# EAGLE schematic EGR226 Project (EAGLE 8.2.2)
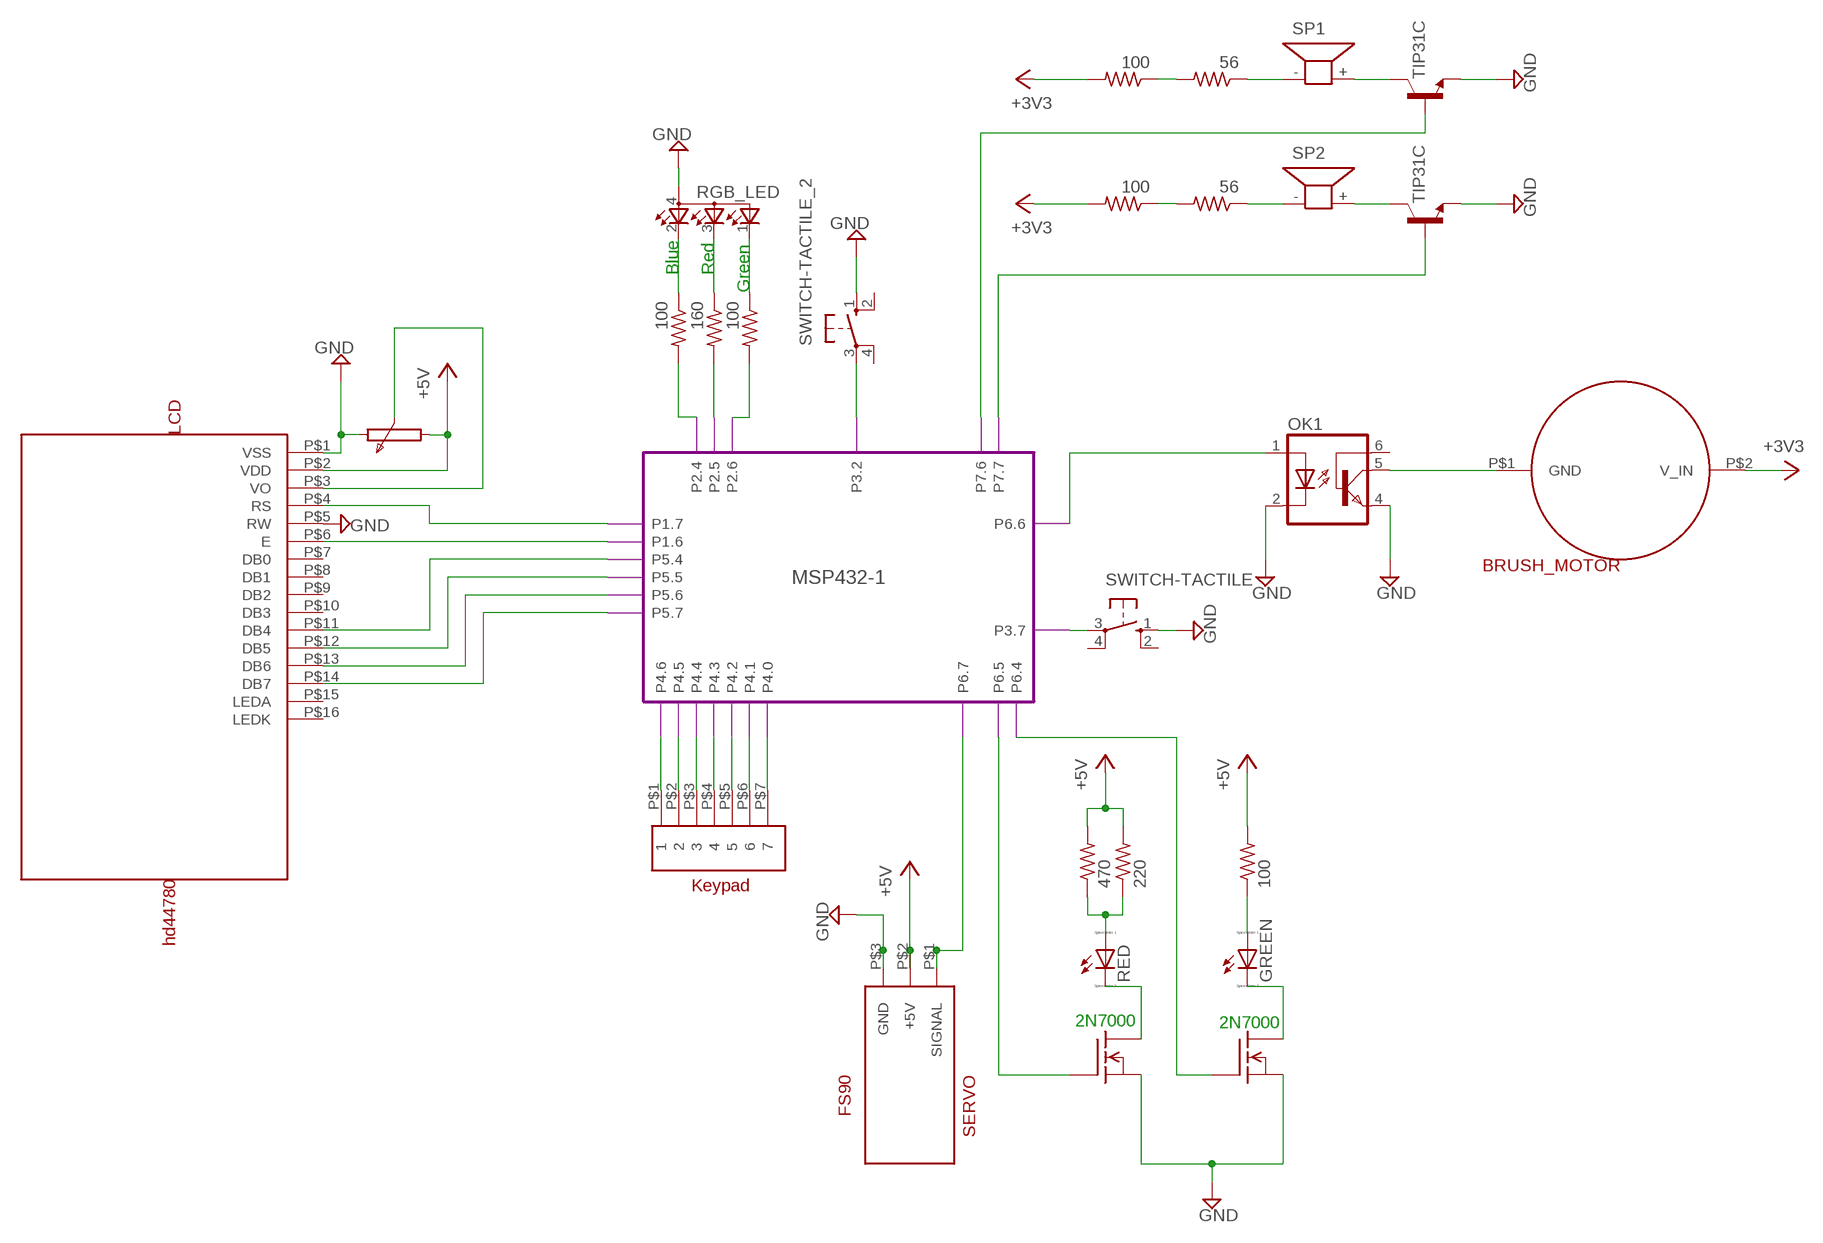
[diagram p0: schematic, sheet 1]

## Parts
2N700  IRF510  [TO220]
2N7000  IRF510  [TO220]
GREEN  LED_ELD260  [LED_LD260]
KEYPAD1  KEYPAD  [KEYPAD]
LCD1  LCD  [LCD]
MOTOR1  DC_MOTOR  [DC_MOTOR]
OK1  IL5  [DIL06]
R1  470  R-US_0204/5  [0204/5]
R2  100  R-US_0204/5  [0204/5]
R3  220  R-US_0204/5  [0204/5]
R4  100  R-US_0204/5  [0204/5]
R5  160  R-US_0204/7  [0204/7]
R6  100  R-US_0204/5  [0204/5]
R7  100  R-US_0204/5  [0204/5]
R8  56  R-US_0204/5  [0204/5]
R9  56  R-US_0204/5  [0204/5]
R10  100  R-US_0204/5  [0204/5]
RED  LED_ELD260  [LED_LD260]
RGB_LED  GM1WA55311A  [GM1WA55311A]
SERVO1  SERVO  [SERVO]
SP1  AL11P  [AL11P]
SP2  AL11P  [AL11P]
SWITCH-TACTILE  10-XX  [B3F-10XX]
SWITCH-TACTILE_2  10-XX  [B3F-10XX]
T1  TIP31C  [TO220]
T4  TIP31C  [TO220]

## Module instances
MSP432-1 = MSP432

## Nets
+3V3: MOTOR1.P$2(V_IN) R6.2 R7.2
+5V: LCD1.P$2(VDD) R1.2 R3.2 R10.2 SERVO1.P$2(+5V)
GND: 2N700.3(S) 2N7000.3(S) LCD1.P$1(VSS) LCD1.P$5(RW) OK1.2(C) OK1.4(EMI) RGB_LED.4(A) SERVO1.P$3(GND) SWITCH-TACTILE.1(S) SWITCH-TACTILE_2.1(S) T1.3(E) T4.3(E)
N$1: SERVO1.P$1(SIGNAL) ; port MSP432-1.P6.7
N$2: OK1.1(A) ; port MSP432-1.P6.6
N$3: MOTOR1.P$1(GND) OK1.5(COL)
N$4: LCD1.P$6(E) ; port MSP432-1.P1.6
N$5: LCD1.P$4(RS) ; port MSP432-1.P1.7
N$6: LCD1.P$11(DB4) ; port MSP432-1.P5.4
N$7: LCD1.P$12(DB5) ; port MSP432-1.P5.5
N$8: LCD1.P$13(DB6) ; port MSP432-1.P5.6
N$9: LCD1.P$14(DB7) ; port MSP432-1.P5.7
N$10: LCD1.P$3(VO)
N$11: KEYPAD1.P$7 ; port MSP432-1.P4.0
N$12: KEYPAD1.P$6 ; port MSP432-1.P4.1
N$13: KEYPAD1.P$5 ; port MSP432-1.P4.2
N$14: KEYPAD1.P$4 ; port MSP432-1.P4.3
N$15: KEYPAD1.P$3 ; port MSP432-1.P4.4
N$16: KEYPAD1.P$2 ; port MSP432-1.P4.5
N$17: KEYPAD1.P$1 ; port MSP432-1.P4.6
N$18: R2.2 ; port MSP432-1.P2.4
N$19: R2.1 RGB_LED.2(CRED)
N$20: R4.2 ; port MSP432-1.P2.6
N$21: 2N700.1(G) ; port MSP432-1.P6.4
N$22: 2N7000.1(G) ; port MSP432-1.P6.5
N$23: SWITCH-TACTILE.3(P) ; port MSP432-1.P3.7
N$24: R1.1 R3.1 RED.A
N$25: 2N7000.2(D) RED.K(C)
N$26: R5.2 ; port MSP432-1.P2.5
N$27: 2N700.2(D) GREEN.K(C)
N$28: GREEN.A R10.1
N$29: R5.1 RGB_LED.3(CBLUE)
N$30: R4.1 RGB_LED.1(CGREEN)
N$31: SWITCH-TACTILE_2.3(P) ; port MSP432-1.P3.2
N$32: R6.1 R8.2
N$33: R7.1 R9.2
N$34: T1.1(B) ; port MSP432-1.P7.6
N$35: T4.1(B) ; port MSP432-1.P7.7
N$36: R8.1 SP1.-
N$37: SP1.+ T1.2(C)
N$38: R9.1 SP2.-
N$39: SP2.+ T4.2(C)
Unconnected: LCD1.P$7(DB0) LCD1.P$8(DB1) LCD1.P$9(DB2) LCD1.P$10(DB3) LCD1.P$15(LEDA) LCD1.P$16(LEDK) OK1.6(BAS) SWITCH-TACTILE.2(S1) SWITCH-TACTILE.4(P1) SWITCH-TACTILE_2.2(S1) SWITCH-TACTILE_2.4(P1)

## Notes on the sheet
- Blue | Red
- Green
- 2N7000 | 2N7000

## Library data of the parts
2N700 2N7000 = transistor-fet:IRF510: N-Channel Enhancement MOSFET (HEXFET); 100V; 5,6A; 0,54Ohm
GREEN RED = eagle-ltspice:LED_E: LED Source: http://www.osram.convergy.de Source: www.luxeon.com Source: www.kingbright.com; SPICEMODEL: NONE; SPICEPREFIX: D; SPICETYPE: diode
KEYPAD1 = Keypad:KEYPAD: 3x4 Keypad (7-Pin)
LCD1 = LCD:LCD: 16x4 HD44780 LCD ICB
MOTOR1 = Motor:DC_MOTOR: Brushed Motor
OK1 = optocoupler:IL5: SIEMENS OPTO COUPLER; MF: VISHAY/TELEFUNKEN; MPN: IL5; OC_FARNELL: 1020203; OC_NEWARK: 58K1726
R1-R10 = resistor:R-US_: RESISTOR, American symbol
RGB_LED = led:GM1WA55311A: Chip LED RGB Source: http://document.sharpsma.com/files/GM1WA55311A_SS.pdf
SERVO1 = Servo:SERVO: FS90 Servo
SP1 SP2 = buzzer:AL11P: SPEAKER Source: Buerklin; OC_FARNELL: unknown; OC_NEWARK: unknown
SWITCH-TACTILE SWITCH-TACTILE_2 = switch-omron:10-XX: OMRON SWITCH; MPN: B3F-1000; OC_FARNELL: 176432; OC_NEWARK: 36M3542
T1 T4 = transistor-neu-to92:TIP31C: NPN TRANSISTOR

## Module MSP432
Ports: P4.0(io) P4.1(io) P4.2(io) P4.3(io) P4.4(io) P4.5(io) P4.6(io) P1.7(io) P1.6(io) P5.4(io) P5.5(io) P5.6(io) P5.7(io) P6.6(io) P6.7(io) P2.4(io) P2.5(io) P2.6(io) P6.5(io) P6.4(io) P3.7(io) P7.7(io) P7.6(io) P3.2(io)

### Library data of the parts